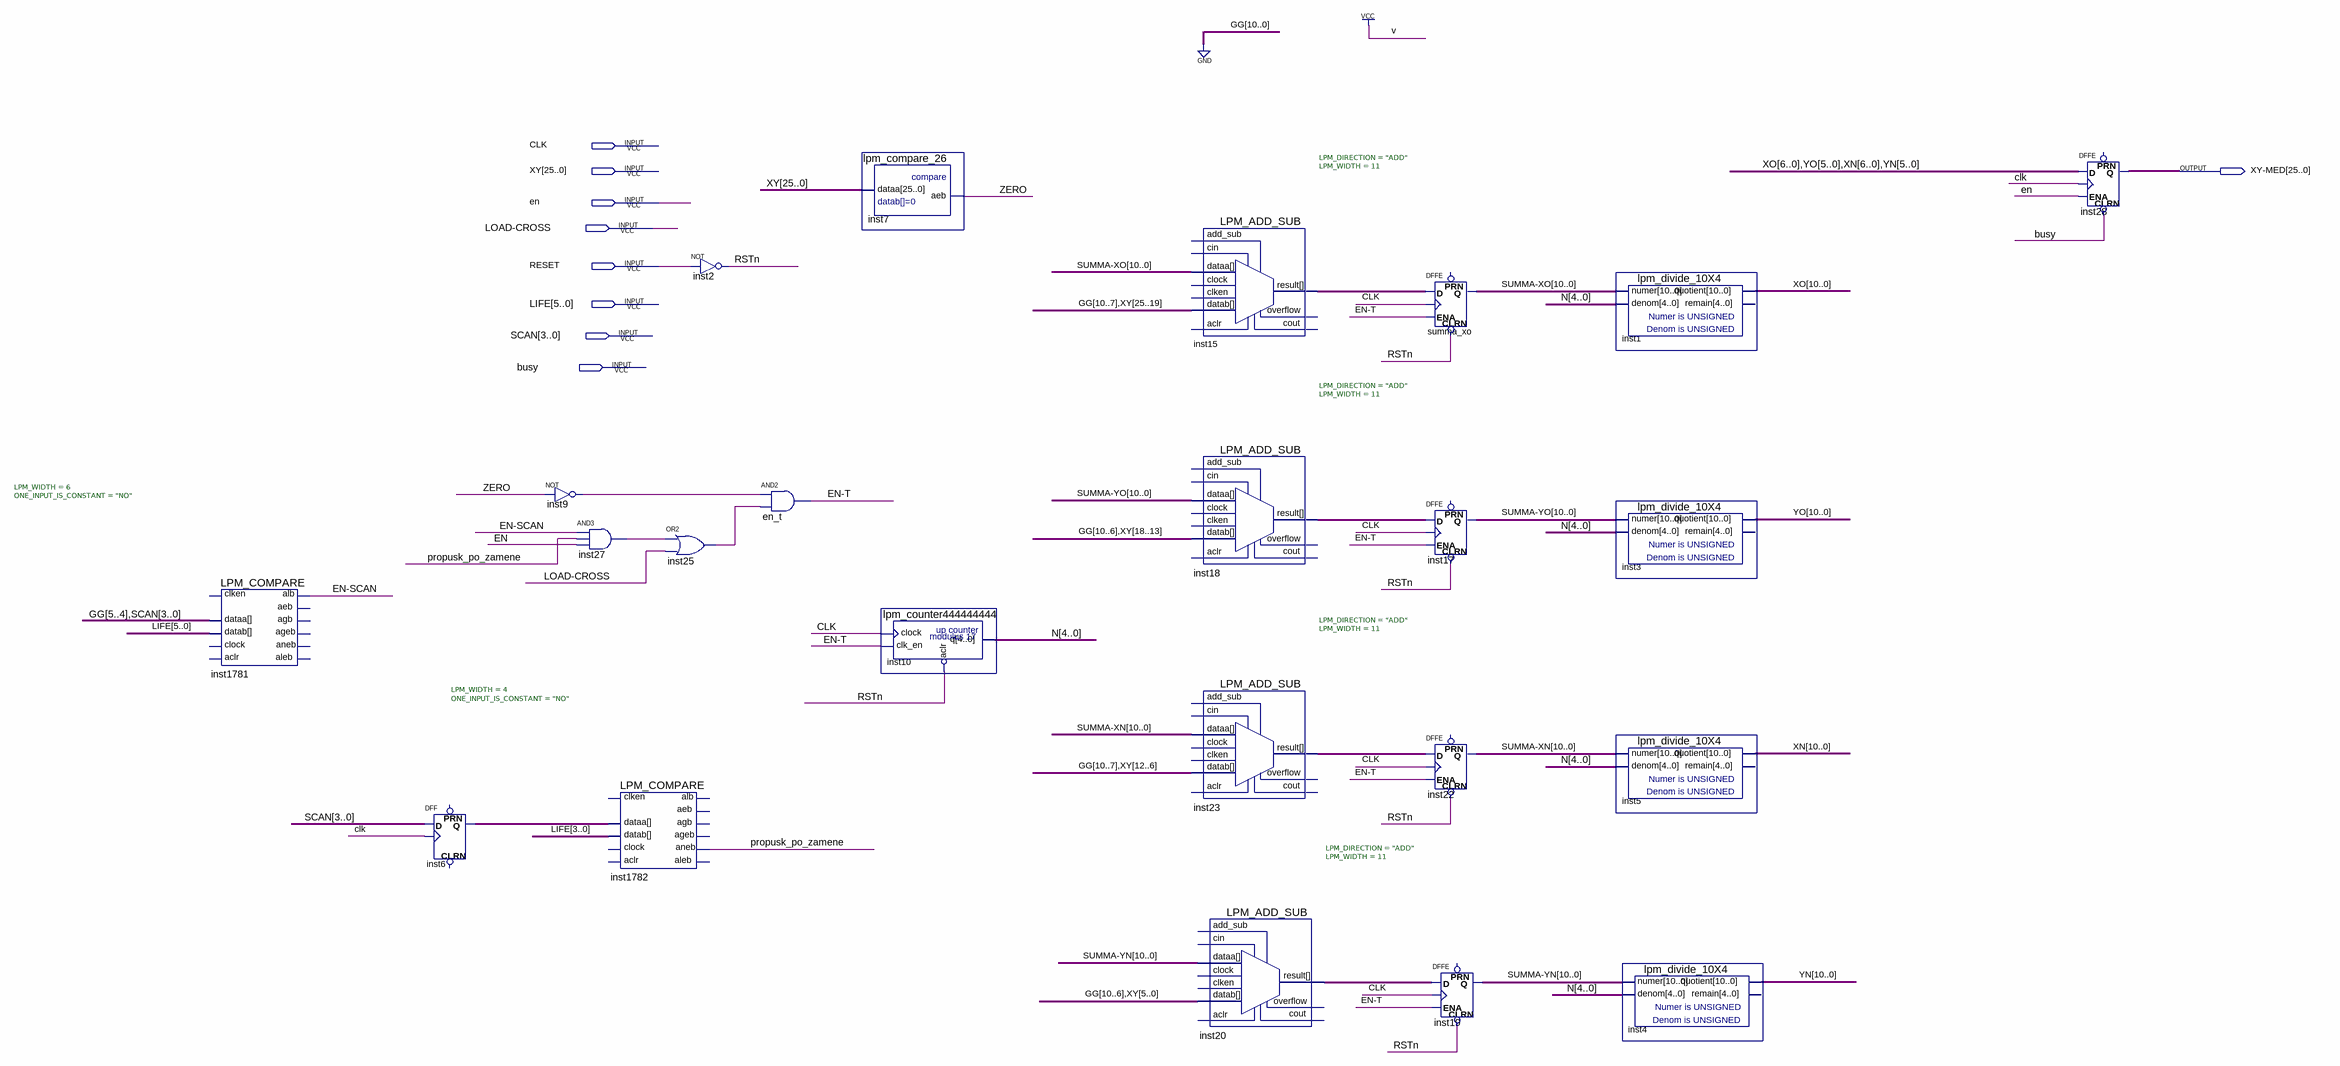
[diagram p0: schematic sheet]
// Quartus schematic htpa_sum_XY.bdf as structural Verilog: 23 symbols, 9 pins
module htpa_sum_XY (
  input  CLK,
  input  [25:0] XY,
  input  en,
  input  \LOAD-CROSS ,
  input  RESET,
  input  [5:0] LIFE,
  input  [3:0] SCAN,
  input  busy,
  output [25:0] \XY-MED 
);

  wire \EN-SCAN , \EN-T , inst9_out, inst25_out, inst27_out, propusk_po_zamene, RSTn, ZERO;
  wire [3:0] inst6_q;
  wire [4:0] N;
  wire [10:0] inst15_result, inst18_result, inst20_result, inst23_result, \SUMMA-XN , \SUMMA-XO , \SUMMA-YN ,
       \SUMMA-YO , XN, XO, YN, YO;

  LPM_COMPARE #(.LPM_WIDTH(6), .ONE_INPUT_IS_CONSTANT("NO")) inst1781 (
    .dataa({2'b00, SCAN}), .datab(LIFE), .alb(\EN-SCAN ));  // open: clock, aclr, clken, aleb, aeb, agb, aneb, ageb
  DFF inst6[3:0] (.CLK(CLK), .D(SCAN), .Q(inst6_q));  // open: CLRN, PRN
  not inst9 (inst9_out, ZERO);
  and inst27 (inst27_out, \EN-SCAN , propusk_po_zamene, en);
  LPM_COMPARE #(.LPM_WIDTH(4), .ONE_INPUT_IS_CONSTANT("NO")) inst1782 (
    .dataa(inst6_q), .datab(LIFE[3:0]), .aneb(propusk_po_zamene));  // open: clock, aclr, clken, aleb, aeb, agb, ageb, alb
  not inst2 (RSTn, RESET);
  or inst25 (inst25_out, inst27_out, \LOAD-CROSS );
  and en_t (\EN-T , inst9_out, inst25_out);
  lpm_compare_26 inst7 (.dataa(XY), .aeb(ZERO));
  lpm_counter444444444 inst10 (.clock(CLK), .clk_en(\EN-T ), .aclr(~RSTn), .q(N));
  LPM_ADD_SUB #(.LPM_DIRECTION("ADD"), .LPM_WIDTH(11)) inst15 (
    .datab({4'b0000, XY[25:19]}), .dataa(\SUMMA-XO ), .result(inst15_result));  // open: add_sub, cin, aclr, clock, clken, cout, overflow
  LPM_ADD_SUB #(.LPM_DIRECTION("ADD"), .LPM_WIDTH(11)) inst18 (
    .datab({{5{1'b0}}, XY[18:13]}), .dataa(\SUMMA-YO ), .result(inst18_result));  // open: add_sub, cin, aclr, clock, clken, cout, overflow
  LPM_ADD_SUB #(.LPM_DIRECTION("ADD"), .LPM_WIDTH(11)) inst23 (
    .datab({4'b0000, XY[12:6]}), .dataa(\SUMMA-XN ), .result(inst23_result));  // open: add_sub, cin, aclr, clock, clken, cout, overflow
  LPM_ADD_SUB #(.LPM_DIRECTION("ADD"), .LPM_WIDTH(11)) inst20 (
    .datab({{5{1'b0}}, XY[5:0]}), .dataa(\SUMMA-YN ), .result(inst20_result));  // open: add_sub, cin, aclr, clock, clken, cout, overflow
  DFFE summa_xo[10:0] (.CLRN(RSTn), .D(inst15_result), .CLK(CLK), .ENA(\EN-T ), .Q(\SUMMA-XO ));  // open: PRN
  DFFE inst17[10:0] (.CLRN(RSTn), .D(inst18_result), .CLK(CLK), .ENA(\EN-T ), .Q(\SUMMA-YO ));  // open: PRN
  DFFE inst22[10:0] (.CLRN(RSTn), .D(inst23_result), .CLK(CLK), .ENA(\EN-T ), .Q(\SUMMA-XN ));  // open: PRN
  DFFE inst19[10:0] (.CLRN(RSTn), .D(inst20_result), .CLK(CLK), .ENA(\EN-T ), .Q(\SUMMA-YN ));  // open: PRN
  lpm_divide_10X4 inst1 (.numer(\SUMMA-XO ), .denom(N), .quotient(XO));  // open: remain
  lpm_divide_10X4 inst3 (.numer(\SUMMA-YO ), .denom(N), .quotient(YO));  // open: remain
  lpm_divide_10X4 inst5 (.numer(\SUMMA-XN ), .denom(N), .quotient(XN));  // open: remain
  lpm_divide_10X4 inst4 (.numer(\SUMMA-YN ), .denom(N), .quotient(YN));  // open: remain
  DFFE inst28[25:0] (
    .CLRN(busy), .D({XO[6:0], YO[5:0], XN[6:0], YN[5:0]}), .CLK(CLK), .ENA(en), .Q(\XY-MED ));  // open: PRN
endmodule
